# Altium schematic sheet max485.SchDoc
size A4
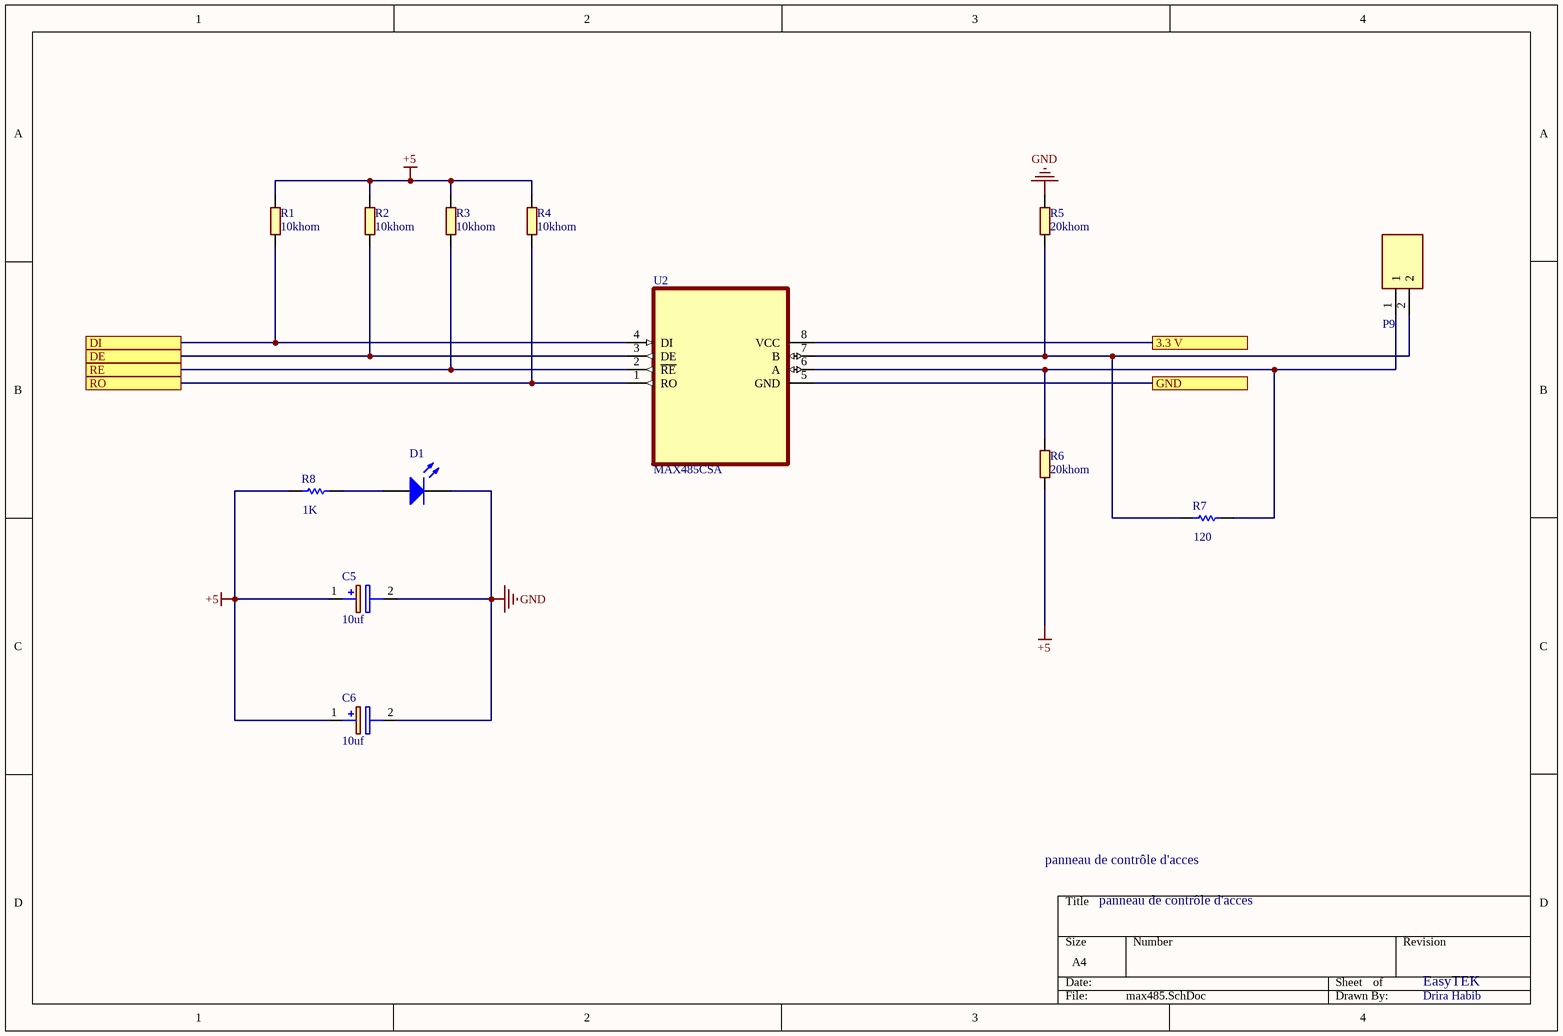
[diagram p0: max485.SchDoc]

## Parts
C5  10uf  [CAPPRD200W55D500H1250]
C6  10uf  [CAPPRD200W55D500H1250]
D1  LED_SMD  [0603_LED]  (value not drawn)
P9  1546215-2  [15462152]  (value not drawn)
R1  10khom  [0603]
R2  10khom  [0603]
R3  10khom  [0603]
R4  10khom  [0603]
R5  20khom  [0603]
R6  20khom  [0603]
R7  value 120  [R0603]  (hidden comment: Res1)
R8  value 1K  [R0603]  (hidden comment: Res1)
U2  MAX485CSA  [SOIC127P600X175-8N]

## Ports
3.3 V, DE, DI, GND, RE, RO

## Nets
+5: C5.1(+) C6.1(+) R1.1 R2.1 R3.1 R4.1 R6.1 R8.1
GND: C5.2(-) C6.2(-) D1.2(K) R5.2
3.3 V: U2.8(VCC) ; port 3.3 V
DE: R2.2 U2.3(DE) ; port DE
DI: R1.2 U2.4(DI) ; port DI
GND: U2.5(GND) ; port GND  [a separate net that carries the same name]
RE: R3.2 U2.2(~{RE}) ; port RE
RO: R4.2 U2.1(RO) ; port RO
NetD1_1: D1.1(A) R8.2
NetP9_1: P9.1 R6.2 R7.2 U2.6(A)
NetP9_2: P9.2 R5.1 R7.1 U2.7(B)

## Notes on the sheet
- panneau de contrôle d'acces
- EasyTEK
- Drira Habib

## Library data of the parts
C5 C6 = EEUFR1H100: Capacitor Polarised; Manufacturer_Name: Panasonic; Datasheet Link: http://industrial.panasonic.com/cdbs/www-data/pdf/RDF0000/ABA0000C1259.pdf; Height: 12.5mm; Manufacturer_Part_Number: EEUFR1H100; Arrow Part Number: EEUFR1H100; Arrow Price/Stock: https://www.arrow.com/en/products/eeufr1h100/panasonic?region=nac
D1 = LED_SMD: LED RED CLEAR 0603 SMD; Manufacturer Part Number: LTST-C191KRKT; PackageReference: 0603 (1608 Metric); PackageDescription: 1.60mm L x 0.80mm W; Digikey Part Number: 160-1447-1-ND; Value: RED
P9 = 1546215-2: Connector; Manufacturer_Name: TE Connectivity; Datasheet Link: https://www.te.com/commerce/DocumentDelivery/DDEController?Action=srchrtrv&DocNm=1546215&DocType=Customer+Drawing&DocLang=English; Height: 10.3mm; Manufacturer_Part_Number: 1546215-2; Mouser Part Number: 571-1546215-2; Mouser Price/Stock: https://www.mouser.co.uk/ProductDetail/TE-Connectivity/1546215-2?qs=Lxq28tKK6BPmJFoAOY7Ljw%3D%3D; Arrow Part Number: 1546215-2; Arrow Price/Stock: https://www.arrow.com/en/products/1546215-2/te-connectivity?region=nac
R1-R6 = RC0603JR-0710KA: RESISTOR, THICK FILM, 10KOHM, 100mW, 5%; MF: Yageo; Availability: Unavailable; Package: 0603 Yageo; Price: None; SnapEDA_Link: https://www.snapeda.com/parts/RC0603JR-0710KA/Yageo/view-part/947164/?ref=snap; MP: RC0603JR-0710KA
  R1-R4: Value: *
  R5 R6: Value: 20Khom
R7 R8 = Res1: Resistor; PackageReference: AXIAL-0.3; PackageDescription: Axial Device, Thru-Hole; 2 Leads; 0.3 in Pin Spacing
U2 = MAX485CSA: Package: None; Value: *; Price: None; MP: MAX485CSA; Availability: Unavailable